# Altium schematic sheet Top.SchDoc
size A3
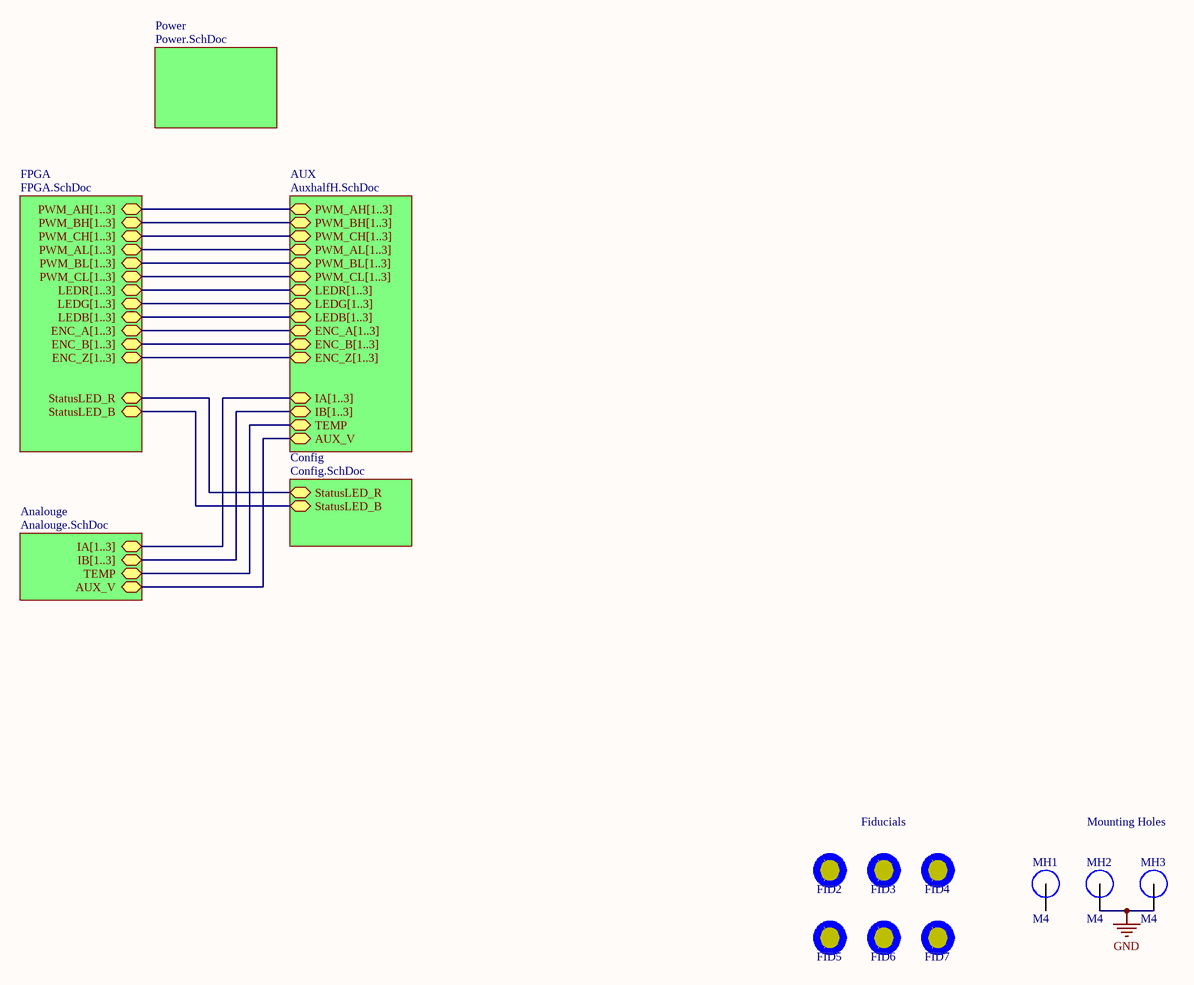
[diagram p0: Top.SchDoc]

## Parts
FID2  FIDUCIAL  [FIDUCIAL]  (value not drawn)
FID3  FIDUCIAL  [FIDUCIAL]  (value not drawn)
FID4  FIDUCIAL  [FIDUCIAL]  (value not drawn)
FID5  FIDUCIAL  [FIDUCIAL]  (value not drawn)
FID6  FIDUCIAL  [FIDUCIAL]  (value not drawn)
FID7  FIDUCIAL  [FIDUCIAL]  (value not drawn)
MH1  M4  [MH_M4]
MH2  M4  [MH_M4]
MH3  M4  [MH_M4]

## Sub-sheets
Analouge = Analouge.SchDoc: AUX_V, IA[1..3], IB[1..3], TEMP
AUX = AuxhalfH.SchDoc: PWM_AH[1..3], PWM_BH[1..3], PWM_CH[1..3], PWM_AL[1..3], PWM_BL[1..3], PWM_CL[1..3], LEDR[1..3], LEDG[1..3], LEDB[1..3], ENC_A[1..3], ENC_B[1..3], ENC_Z[1..3], IA[1..3], IB[1..3], AUX_V, TEMP
Config = Config.SchDoc: StatusLED_B, StatusLED_R
FPGA = FPGA.SchDoc: PWM_AH[1..3], PWM_BH[1..3], PWM_CH[1..3], PWM_AL[1..3], PWM_BL[1..3], PWM_CL[1..3], LEDR[1..3], LEDG[1..3], LEDB[1..3], ENC_A[1..3], ENC_B[1..3], ENC_Z[1..3], StatusLED_B, StatusLED_R
Power = Power.SchDoc: no entries

## Nets
GND: MH2.1 MH3.1
(unnamed): sheet AUX/AUX_V, sheet Analouge/AUX_V
(unnamed): sheet AUX/TEMP, sheet Analouge/TEMP
(unnamed): sheet FPGA/StatusLED_B, sheet Config/StatusLED_B
(unnamed): sheet FPGA/StatusLED_R, sheet Config/StatusLED_R

Not connected (* = marked no-connect by the designer): MH1 1

## Buses and harness runs
bus sheet Analouge/IA[1..3] = sheet AUX/IA[1..3]
bus sheet Analouge/IB[1..3] = sheet AUX/IB[1..3]
bus sheet AUX/ENC_A[1..3] = sheet FPGA/ENC_A[1..3]
bus sheet AUX/ENC_B[1..3] = sheet FPGA/ENC_B[1..3]
bus sheet AUX/ENC_Z[1..3] = sheet FPGA/ENC_Z[1..3]
bus sheet AUX/LEDB[1..3] = sheet FPGA/LEDB[1..3]
bus sheet AUX/LEDG[1..3] = sheet FPGA/LEDG[1..3]
bus sheet AUX/LEDR[1..3] = sheet FPGA/LEDR[1..3]
bus sheet AUX/PWM_AH[1..3] = sheet FPGA/PWM_AH[1..3]
bus sheet AUX/PWM_AL[1..3] = sheet FPGA/PWM_AL[1..3]
bus sheet AUX/PWM_BH[1..3] = sheet FPGA/PWM_BH[1..3]
bus sheet AUX/PWM_BL[1..3] = sheet FPGA/PWM_BL[1..3]
bus sheet AUX/PWM_CH[1..3] = sheet FPGA/PWM_CH[1..3]
bus sheet AUX/PWM_CL[1..3] = sheet FPGA/PWM_CL[1..3]

## Notes on the sheet
- Fiducials
- Mounting Holes

## Library data of the parts
FID2-FID7 = FIDUCIAL: 1mm Fiducial with 2mm soldermask, 3mm keepout
MH1-MH3 = MH_M4: M4 Mounting Hole